# Altium schematic sheet ct_userio.SchDoc: User I/O
size Letter; Organization: NewAE Technology Inc.; Address1: 1083 Queen St., Suite 196; Address2: Halifax; Address3: NS; Address4: Canada B3H 0B2; SheetNumber: 8; SheetTotal: 8; SheetApproved: YES
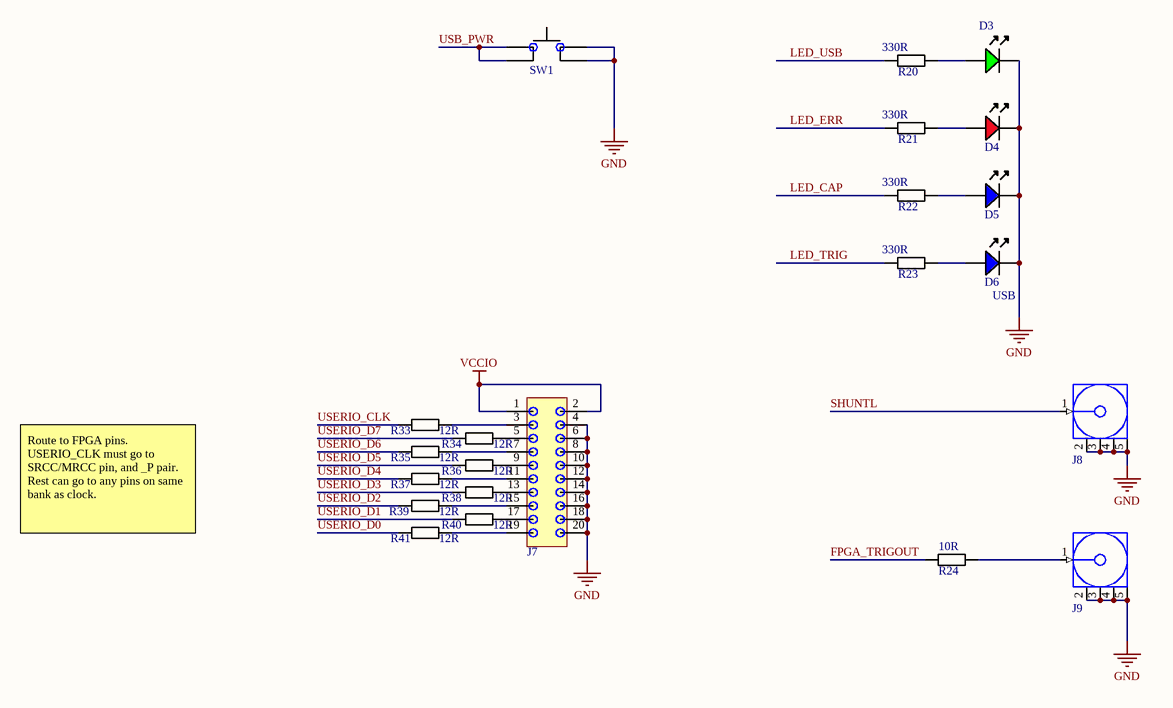
[diagram p0: ct_userio.SchDoc]

## Parts
D3  (no value)  [LED-0603-GREEN]
D4  LED, 0603, Red  [LED-0603-RED]  (value not drawn)
D5  LED, 0603, Blue  [LED-0603-BLUE]  (value not drawn)
D6  USB  [LED-0603-BLUE]
J7  EW-10-09-G-D-300  [EW-10-09-G-D-300]  (value not drawn)
J8  MCX 733660061  [CONN_MCX_733660061]  (value not drawn)
J9  MCX 733660061  [CONN_MCX_733660061]  (value not drawn)
R20  330R  [RESC1608X55N]
R21  330R  [RESC1608X55N]
R22  330R  [RESC1608X55N]
R23  330R  [RESC1608X55N]
R24  10R  [RESC1608X55N]
R33  12R  [RESC1005X40N]
R34  12R  [RESC1005X40N]
R35  12R  [RESC1005X40N]
R36  12R  [RESC1005X40N]
R37  12R  [RESC1005X40N]
R38  12R  [RESC1005X40N]
R39  12R  [RESC1005X40N]
R40  12R  [RESC1005X40N]
R41  12R  [RESC1005X40N]
SW1  KSC741J LFS  [CK_KSC7J]  (value not drawn)

## Nets
GND: D3.K D4.K D5.K D6.K J7.4 J7.6 J7.8 J7.10 J7.12 J7.14 J7.16 J7.18 J7.20 J8.2(GND) J8.3(GND) J8.4(GND) J8.5(GND) J9.2(GND) J9.3(GND) J9.4(GND) J9.5(GND) SW1.2(IN) SW1.3(IN)
VCCIO: J7.1 J7.2
FPGA_TRIGOUT: R24.1
LED_CAP: R22.1
LED_ERR: R21.1
LED_TRIG: R23.1
LED_USB: R20.1
SHUNTL: J8.1(Signal)
USB_PWR: SW1.1(IN) SW1.4(IN)
USERIO_CLK: R33.1
USERIO_D0: R41.1
USERIO_D1: R40.1
USERIO_D2: R39.1
USERIO_D3: R38.1
USERIO_D4: R37.1
USERIO_D5: R36.1
USERIO_D6: R35.1
USERIO_D7: R34.1
NetD3_A: D3.A R20.2
NetD4_A: D4.A R21.2
NetD5_A: D5.A R22.2
NetD6_A: D6.A R23.2
NetJ7_3: J7.3 R33.2
NetJ7_5: J7.5 R34.2
NetJ7_7: J7.7 R35.2
NetJ7_9: J7.9 R36.2
NetJ7_11: J7.11 R37.2
NetJ7_13: J7.13 R38.2
NetJ7_15: J7.15 R39.2
NetJ7_17: J7.17 R40.2
NetJ7_19: J7.19 R41.2
NetJ9_1: J9.1(Signal) R24.2

## Notes on the sheet
- Route to FPGA pins. USERIO_CLK must go to SRCC/MRCC pin, and _P pair. Rest can go to any pins on same bank as clock.
- Title:
- Date:
- Rev:
- Time:
- Project:
- Sheet
- of
- License:
- Copyright © NewAE Technology Inc.
- Approved:
- NewAE.com
- File:

## Library data of the parts
D3 = LEDCHIP_0603_GREEN: Chip LED, Green; Manufacture 1: Kingbright; Manufacture Part Number 1: APT1608CGCK; Component Group: Optical; PP Material Stack: 16; PP Rotation: -90; Part Number: LEDCHIP_0603_GREEN; Pin Count: 2; Supplier 1: Digi-Key; Supplier Part Number 1: 754-1116-1-ND; Mounting Technology: SMT; Component Kind: Standard; Component Type: Standard
D4 = LEDCHIP_0603_RED: Chip LED, Red; Manufacture 1: Kingbright; Manufacture Part Number 1: APT1608SRCPRV; Component Group: Optical; PP Material Stack: 15; PP Rotation: -90; Part Number: LEDCHIP_0603_RED; Pin Count: 2; Supplier 1: Digi-Key; Supplier Part Number 1: 754-1122-1-ND; Mounting Technology: SMT; Component Kind: Standard; Component Type: Standard
D5 D6 = LEDCHIP_0603_BLUE: Chip LED, Blue; Manufacture 1: Kingbright; Component Group: Optical; Part Number: LEDCHIP_0603_BLUE; Pin Count: 2; Mounting Technology: SMT; Component Kind: Standard; Component Type: Standard
J7 = EW-10-09-G-D-300: 20-Pin Header, High-Top; Part Number: SBH11-PBPC-D10-ST-BK; Component Group: Connector; PP Material Stack: 0; Manufacture Part Number 1: SBH11-PBPC-D10-ST-BK; Pin Count: 20; Supplier 1: Digi-key; Component Kind: Standard; Component Type: Standard; PP Rotation: 0; Supplier Part Number 1: S9172-ND
J8 J9 = 733660061: MCX Straight; Manufacture Part Number 1: 29K101-400L5; Component Group: Connector; PP Material Stack: 0; Part Number: 733660061; Pin Count: 5; Supplier 1: Digi-Key; Mounting Technology: Through-hole; RoHS: Yes; Component Kind: Standard; Component Type: Standard; PP Rotation: 0; Supplier Part Number 1: 1868-1160-ND
R20-R23 = RCHIP-330R-0603: 330R res, 0603, 1%, 1/10W; Manufacture 1: Yageo; Manufacture Part Number 1: RC0603FR-07330RL; Component Group: Resistor; Case-EIA: 0603; Case-Metric: 1608; Rated Power: 0.1W; Rated Voltage: 75VDC; Part Number: RCHIP-330R-0603; Footprint: 0603; Pin Count: 2; Supplier 1: Digi-Key; Supplier Part Number 1: 311-330HRCT-ND; Value: 330R; Tolerance: 1%; Mounting Technology: SMT; Temperature Range: -55C to 155C; Component Kind: Standard; Component Type: Standard
R24 = RCHIP-10R-0603: 10R res, 0603, 1%, 1/10W; Manufacture 1: Yageo; Manufacture Part Number 1: RC0603FR-0710RL; Component Group: Resistor; Case-EIA: 0603; Case-Metric: 1608; Rated Power: 0.1W; Rated Voltage: 75VDC; Part Number: RCHIP-10R-0603; Footprint: 0603; Pin Count: 2; Supplier 1: Digi-Key; Supplier Part Number 1: 311-10.0HRCT-ND; Value: 10R; Tolerance: 1%; Mounting Technology: SMT; Temperature Range: -55C to 155C; Component Kind: Standard; Component Type: Standard
R33-R41 = RCHIP-12R-0402: 12R res, 0402, 1%, 1/16W; Manufacture 1: Yageo; Manufacture Part Number 1: RC0402FR-0712RL; Component Group: Resistor; Case-EIA: 0402; Case-Metric: 1005; Rated Power: 0.063W; Rated Voltage: 75VDC; Part Number: RCHIP-12R-0402; Footprint: 0402; Pin Count: 2; Supplier 1: Digi-Key; Supplier Part Number 1: YAG2968CT-ND; Value: 12R; Tolerance: 1%; Mounting Technology: SMT; Temperature Range: -55C to 155C; Component Kind: Standard; Component Type: Standard
SW1 = TACTSW-KSC741J: SWITCH TACTILE SPST-NO 0.01A 32V; Manufacture 1: C&K; PP Material Stack: 0; Part Number: TACTSW-KSC741J; Component Group: Switch; Manufacture Part Number 1: KSC741J LFS; Pin Count: 4; Supplier 1: Digi-Key; Supplier Part Number 1: CKN10309CT-ND; Mounting Technology: SMT; RoHS: Yes; Component Kind: Standard; Component Type: Standard; PP Rotation: 0